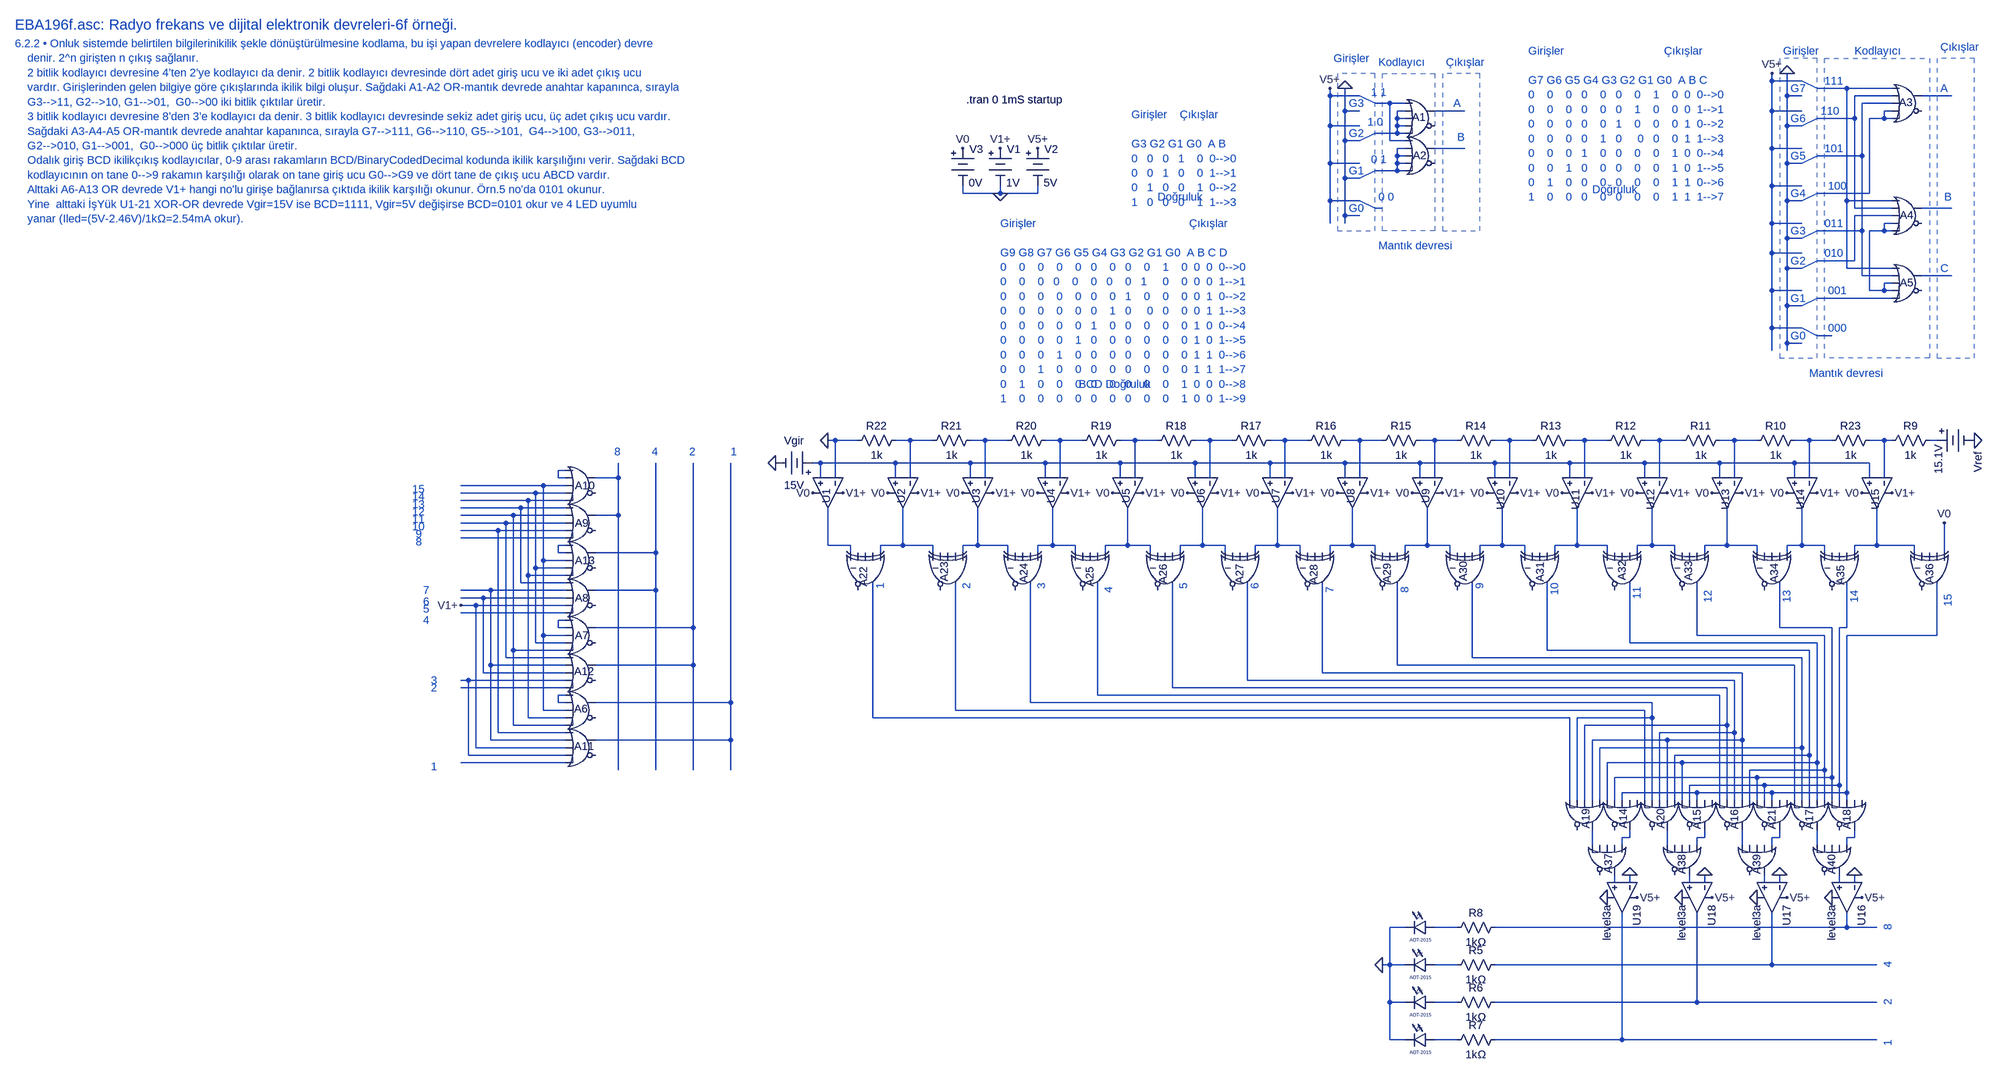
[diagram p0: schematic EBA196f.asc]
EBA196f.asc, the LTspice schematic file:
Version 4
SHEET 1 7064 4332
WIRE 3520 176 3520 160
WIRE 3584 176 3520 176
WIRE 3616 192 3584 176
WIRE 3680 192 3616 192
WIRE 3776 192 3680 192
WIRE 2576 208 2576 192
WIRE 2640 208 2576 208
WIRE 3552 208 3552 160
WIRE 3584 208 3552 208
WIRE 3776 208 3696 208
WIRE 3904 208 3840 208
WIRE 2672 224 2640 208
WIRE 2704 224 2672 224
WIRE 2736 224 2704 224
WIRE 3776 224 3712 224
WIRE 2608 240 2608 192
WIRE 2640 240 2608 240
WIRE 2736 240 2720 240
WIRE 2864 240 2800 240
WIRE 3520 240 3520 176
WIRE 3584 240 3520 240
WIRE 3776 240 3760 240
WIRE 2720 256 2720 240
WIRE 2736 256 2720 256
WIRE 3696 256 3696 208
WIRE 3696 256 3616 256
WIRE 3760 256 3760 240
WIRE 3760 256 3728 256
WIRE 3776 256 3760 256
WIRE 2576 272 2576 208
WIRE 2640 272 2576 272
WIRE 2720 272 2720 256
WIRE 2736 272 2720 272
WIRE 3552 272 3552 208
WIRE 3584 272 3616 256
WIRE 3584 272 3552 272
WIRE 2720 288 2720 272
WIRE 2720 288 2672 288
WIRE 2736 288 2720 288
WIRE 2608 304 2608 240
WIRE 2640 304 2672 288
WIRE 2640 304 2608 304
WIRE 2704 304 2704 224
WIRE 2736 304 2704 304
WIRE 2736 320 2720 320
WIRE 2864 320 2800 320
WIRE 3520 320 3520 240
WIRE 3584 320 3520 320
WIRE 2720 336 2720 320
WIRE 2736 336 2720 336
WIRE 3712 336 3712 224
WIRE 3712 336 3616 336
WIRE 2576 352 2576 272
WIRE 2640 352 2576 352
WIRE 2720 352 2720 336
WIRE 2736 352 2720 352
WIRE 3552 352 3552 272
WIRE 3584 352 3616 336
WIRE 3584 352 3552 352
WIRE 2720 368 2720 352
WIRE 2720 368 2672 368
WIRE 2736 368 2720 368
WIRE 2608 384 2608 304
WIRE 2640 384 2672 368
WIRE 2640 384 2608 384
WIRE 3520 400 3520 320
WIRE 3584 400 3520 400
WIRE 1792 416 1792 400
WIRE 1872 416 1872 400
WIRE 1872 416 1792 416
WIRE 1952 416 1952 400
WIRE 1952 416 1872 416
WIRE 3728 416 3728 256
WIRE 3728 416 3616 416
WIRE 2576 432 2576 352
WIRE 2640 432 2576 432
WIRE 3552 432 3552 352
WIRE 3584 432 3616 416
WIRE 3584 432 3552 432
WIRE 3680 432 3680 192
WIRE 3776 432 3680 432
WIRE 2672 448 2640 432
WIRE 2688 448 2672 448
WIRE 3696 448 3696 256
WIRE 3776 448 3696 448
WIRE 3904 448 3840 448
WIRE 2608 464 2608 384
WIRE 2640 464 2608 464
WIRE 3776 464 3696 464
WIRE 2576 480 2576 432
WIRE 2608 480 2608 464
WIRE 3520 480 3520 400
WIRE 3584 480 3520 480
WIRE 3776 480 3760 480
WIRE 3712 496 3712 336
WIRE 3712 496 3616 496
WIRE 3760 496 3760 480
WIRE 3760 496 3728 496
WIRE 3776 496 3760 496
WIRE 3552 512 3552 432
WIRE 3584 512 3616 496
WIRE 3584 512 3552 512
WIRE 3520 544 3520 480
WIRE 3584 544 3520 544
WIRE 3696 560 3696 464
WIRE 3696 560 3616 560
WIRE 3552 576 3552 512
WIRE 3584 576 3616 560
WIRE 3584 576 3552 576
WIRE 3680 576 3680 432
WIRE 3776 576 3680 576
WIRE 3712 592 3712 496
WIRE 3776 592 3712 592
WIRE 3904 592 3840 592
WIRE 3776 608 3760 608
WIRE 3520 624 3520 544
WIRE 3584 624 3520 624
WIRE 3728 624 3728 496
WIRE 3760 624 3760 608
WIRE 3760 624 3728 624
WIRE 3776 624 3760 624
WIRE 3776 640 3616 640
WIRE 3552 656 3552 576
WIRE 3584 656 3616 640
WIRE 3584 656 3552 656
WIRE 3520 704 3520 624
WIRE 3584 704 3520 704
WIRE 3616 720 3584 704
WIRE 3648 720 3616 720
WIRE 3552 736 3552 656
WIRE 3584 736 3552 736
WIRE 3520 752 3520 704
WIRE 3552 752 3552 736
WIRE 1520 944 1504 944
WIRE 1568 944 1520 944
WIRE 1680 944 1648 944
WIRE 1728 944 1680 944
WIRE 1840 944 1808 944
WIRE 1888 944 1840 944
WIRE 2000 944 1968 944
WIRE 2048 944 2000 944
WIRE 2160 944 2128 944
WIRE 2208 944 2160 944
WIRE 2320 944 2288 944
WIRE 2368 944 2320 944
WIRE 2480 944 2448 944
WIRE 2528 944 2480 944
WIRE 2640 944 2608 944
WIRE 2688 944 2640 944
WIRE 2800 944 2768 944
WIRE 2848 944 2800 944
WIRE 2960 944 2928 944
WIRE 3008 944 2960 944
WIRE 3120 944 3088 944
WIRE 3168 944 3120 944
WIRE 3280 944 3248 944
WIRE 3328 944 3280 944
WIRE 3440 944 3408 944
WIRE 3488 944 3440 944
WIRE 3600 944 3568 944
WIRE 3648 944 3600 944
WIRE 3760 944 3728 944
WIRE 3776 944 3760 944
WIRE 3872 944 3856 944
WIRE 1488 992 1472 992
WIRE 1648 992 1488 992
WIRE 1808 992 1648 992
WIRE 1968 992 1808 992
WIRE 2128 992 1968 992
WIRE 2288 992 2128 992
WIRE 2448 992 2288 992
WIRE 2608 992 2448 992
WIRE 2768 992 2608 992
WIRE 2928 992 2768 992
WIRE 3088 992 2928 992
WIRE 3248 992 3088 992
WIRE 3408 992 3248 992
WIRE 3568 992 3408 992
WIRE 3728 992 3568 992
WIRE 944 1008 928 1008
WIRE 928 1024 928 1008
WIRE 944 1024 928 1024
WIRE 1056 1024 1056 992
WIRE 1056 1024 1008 1024
WIRE 1488 1024 1488 992
WIRE 1520 1024 1520 944
WIRE 1648 1024 1648 992
WIRE 1680 1024 1680 944
WIRE 1808 1024 1808 992
WIRE 1840 1024 1840 944
WIRE 1968 1024 1968 992
WIRE 2000 1024 2000 944
WIRE 2128 1024 2128 992
WIRE 2160 1024 2160 944
WIRE 2288 1024 2288 992
WIRE 2320 1024 2320 944
WIRE 2448 1024 2448 992
WIRE 2480 1024 2480 944
WIRE 2608 1024 2608 992
WIRE 2640 1024 2640 944
WIRE 2768 1024 2768 992
WIRE 2800 1024 2800 944
WIRE 2928 1024 2928 992
WIRE 2960 1024 2960 944
WIRE 3088 1024 3088 992
WIRE 3120 1024 3120 944
WIRE 3248 1024 3248 992
WIRE 3280 1024 3280 944
WIRE 3408 1024 3408 992
WIRE 3440 1024 3440 944
WIRE 3568 1024 3568 992
WIRE 3600 1024 3600 944
WIRE 3728 1024 3728 992
WIRE 3760 1024 3760 944
WIRE 896 1040 720 1040
WIRE 944 1040 896 1040
WIRE 880 1056 720 1056
WIRE 944 1056 880 1056
WIRE 864 1072 720 1072
WIRE 944 1072 864 1072
WIRE 848 1088 720 1088
WIRE 944 1088 848 1088
WIRE 832 1104 720 1104
WIRE 944 1104 832 1104
WIRE 1056 1104 1056 1024
WIRE 1056 1104 1008 1104
WIRE 816 1120 720 1120
WIRE 944 1120 816 1120
WIRE 800 1136 720 1136
WIRE 944 1136 800 1136
WIRE 944 1152 720 1152
WIRE 944 1168 928 1168
WIRE 1504 1168 1504 1088
WIRE 1552 1168 1504 1168
WIRE 1664 1168 1664 1088
WIRE 1664 1168 1616 1168
WIRE 1728 1168 1664 1168
WIRE 1824 1168 1824 1088
WIRE 1824 1168 1792 1168
WIRE 1888 1168 1824 1168
WIRE 1984 1168 1984 1088
WIRE 1984 1168 1952 1168
WIRE 2032 1168 1984 1168
WIRE 2144 1168 2144 1088
WIRE 2144 1168 2096 1168
WIRE 2192 1168 2144 1168
WIRE 2304 1168 2304 1088
WIRE 2304 1168 2256 1168
WIRE 2352 1168 2304 1168
WIRE 2464 1168 2464 1088
WIRE 2464 1168 2416 1168
WIRE 2512 1168 2464 1168
WIRE 2624 1168 2624 1088
WIRE 2624 1168 2576 1168
WIRE 2672 1168 2624 1168
WIRE 2784 1168 2784 1088
WIRE 2784 1168 2736 1168
WIRE 2832 1168 2784 1168
WIRE 2944 1168 2944 1088
WIRE 2944 1168 2896 1168
WIRE 2992 1168 2944 1168
WIRE 3104 1168 3104 1088
WIRE 3104 1168 3056 1168
WIRE 3168 1168 3104 1168
WIRE 3264 1168 3264 1088
WIRE 3264 1168 3232 1168
WIRE 3312 1168 3264 1168
WIRE 3424 1168 3424 1088
WIRE 3424 1168 3376 1168
WIRE 3488 1168 3424 1168
WIRE 3584 1168 3584 1088
WIRE 3584 1168 3552 1168
WIRE 3632 1168 3584 1168
WIRE 3744 1168 3744 1088
WIRE 3744 1168 3696 1168
WIRE 3824 1168 3744 1168
WIRE 928 1184 928 1168
WIRE 944 1184 928 1184
WIRE 1136 1184 1136 992
WIRE 1136 1184 1008 1184
WIRE 1552 1184 1552 1168
WIRE 1616 1184 1616 1168
WIRE 1728 1184 1728 1168
WIRE 1792 1184 1792 1168
WIRE 1888 1184 1888 1168
WIRE 1952 1184 1952 1168
WIRE 2032 1184 2032 1168
WIRE 2096 1184 2096 1168
WIRE 2192 1184 2192 1168
WIRE 2256 1184 2256 1168
WIRE 2352 1184 2352 1168
WIRE 2416 1184 2416 1168
WIRE 2512 1184 2512 1168
WIRE 2576 1184 2576 1168
WIRE 2672 1184 2672 1168
WIRE 2736 1184 2736 1168
WIRE 2832 1184 2832 1168
WIRE 2896 1184 2896 1168
WIRE 2992 1184 2992 1168
WIRE 3056 1184 3056 1168
WIRE 3168 1184 3168 1168
WIRE 3232 1184 3232 1168
WIRE 3312 1184 3312 1168
WIRE 3376 1184 3376 1168
WIRE 3488 1184 3488 1168
WIRE 3552 1184 3552 1168
WIRE 3632 1184 3632 1168
WIRE 3696 1184 3696 1168
WIRE 3824 1184 3824 1168
WIRE 3888 1184 3888 1120
WIRE 896 1200 896 1040
WIRE 944 1200 896 1200
WIRE 880 1216 880 1056
WIRE 944 1216 880 1216
WIRE 864 1232 864 1072
WIRE 944 1232 864 1232
WIRE 848 1248 848 1088
WIRE 944 1248 848 1248
WIRE 784 1264 720 1264
WIRE 944 1264 784 1264
WIRE 1136 1264 1136 1184
WIRE 1136 1264 1008 1264
WIRE 768 1280 720 1280
WIRE 944 1280 768 1280
WIRE 752 1296 720 1296
WIRE 944 1296 752 1296
WIRE 944 1312 720 1312
WIRE 944 1328 928 1328
WIRE 928 1344 928 1328
WIRE 944 1344 928 1344
WIRE 1216 1344 1216 992
WIRE 1216 1344 1008 1344
WIRE 3536 1344 3536 1248
WIRE 3648 1344 3536 1344
WIRE 3680 1344 3680 1248
WIRE 3680 1344 3664 1344
WIRE 896 1360 896 1200
WIRE 944 1360 896 1360
WIRE 3360 1360 3360 1248
WIRE 3632 1360 3360 1360
WIRE 3872 1360 3872 1248
WIRE 3872 1360 3680 1360
WIRE 880 1376 880 1216
WIRE 944 1376 880 1376
WIRE 3216 1376 3216 1248
WIRE 3616 1376 3216 1376
WIRE 832 1392 832 1104
WIRE 944 1392 832 1392
WIRE 3040 1392 3040 1248
WIRE 3600 1392 3040 1392
WIRE 816 1408 816 1120
WIRE 944 1408 816 1408
WIRE 2880 1408 2880 1248
WIRE 3584 1408 2880 1408
WIRE 784 1424 784 1264
WIRE 944 1424 784 1424
WIRE 1216 1424 1216 1344
WIRE 1216 1424 1008 1424
WIRE 2720 1424 2720 1248
WIRE 3568 1424 2720 1424
WIRE 768 1440 768 1280
WIRE 944 1440 768 1440
WIRE 2560 1440 2560 1248
WIRE 3456 1440 2560 1440
WIRE 736 1456 720 1456
WIRE 944 1456 736 1456
WIRE 2400 1456 2400 1248
WIRE 3440 1456 2400 1456
WIRE 944 1472 720 1472
WIRE 2240 1472 2240 1248
WIRE 3424 1472 2240 1472
WIRE 944 1488 928 1488
WIRE 2080 1488 2080 1248
WIRE 3408 1488 2080 1488
WIRE 928 1504 928 1488
WIRE 944 1504 928 1504
WIRE 1296 1504 1296 992
WIRE 1296 1504 1008 1504
WIRE 1936 1504 1936 1248
WIRE 3264 1504 1936 1504
WIRE 896 1520 896 1360
WIRE 944 1520 896 1520
WIRE 1776 1520 1776 1248
WIRE 3248 1520 1776 1520
WIRE 864 1536 864 1232
WIRE 944 1536 864 1536
WIRE 1600 1536 1600 1248
WIRE 3088 1536 1600 1536
WIRE 3264 1536 3264 1504
WIRE 3264 1536 3104 1536
WIRE 832 1552 832 1392
WIRE 944 1552 832 1552
WIRE 3424 1552 3424 1472
WIRE 3424 1552 3120 1552
WIRE 800 1568 800 1136
WIRE 944 1568 800 1568
WIRE 3440 1568 3440 1456
WIRE 3440 1568 3280 1568
WIRE 784 1584 784 1424
WIRE 944 1584 784 1584
WIRE 1296 1584 1296 1504
WIRE 1296 1584 1008 1584
WIRE 3296 1584 3136 1584
WIRE 3456 1584 3456 1440
WIRE 3456 1584 3296 1584
WIRE 752 1600 752 1296
WIRE 944 1600 752 1600
WIRE 3584 1600 3584 1408
WIRE 3584 1600 3152 1600
WIRE 736 1616 736 1456
WIRE 944 1616 736 1616
WIRE 3600 1616 3600 1392
WIRE 3600 1616 3312 1616
WIRE 944 1632 720 1632
WIRE 3328 1632 3168 1632
WIRE 3616 1632 3616 1376
WIRE 3616 1632 3328 1632
WIRE 1056 1648 1056 1104
WIRE 1136 1648 1136 1264
WIRE 1216 1648 1216 1424
WIRE 1296 1648 1296 1584
WIRE 3632 1648 3632 1360
WIRE 3632 1648 3472 1648
WIRE 3488 1664 3184 1664
WIRE 3648 1664 3648 1344
WIRE 3648 1664 3488 1664
WIRE 3504 1680 3344 1680
WIRE 3664 1680 3664 1344
WIRE 3664 1680 3504 1680
WIRE 3360 1696 3200 1696
WIRE 3520 1696 3360 1696
WIRE 3680 1696 3680 1360
WIRE 3680 1696 3520 1696
WIRE 3088 1712 3088 1536
WIRE 3104 1712 3104 1536
WIRE 3120 1712 3120 1552
WIRE 3136 1712 3136 1584
WIRE 3152 1712 3152 1600
WIRE 3168 1712 3168 1632
WIRE 3184 1712 3184 1664
WIRE 3200 1712 3200 1696
WIRE 3248 1712 3248 1520
WIRE 3264 1712 3264 1536
WIRE 3280 1712 3280 1568
WIRE 3296 1712 3296 1584
WIRE 3312 1712 3312 1616
WIRE 3328 1712 3328 1632
WIRE 3344 1712 3344 1680
WIRE 3360 1712 3360 1696
WIRE 3408 1712 3408 1488
WIRE 3424 1712 3424 1552
WIRE 3440 1712 3440 1568
WIRE 3456 1712 3456 1584
WIRE 3472 1712 3472 1648
WIRE 3488 1712 3488 1664
WIRE 3504 1712 3504 1680
WIRE 3520 1712 3520 1696
WIRE 3568 1712 3568 1424
WIRE 3584 1712 3584 1600
WIRE 3600 1712 3600 1616
WIRE 3616 1712 3616 1632
WIRE 3632 1712 3632 1648
WIRE 3648 1712 3648 1664
WIRE 3664 1712 3664 1680
WIRE 3680 1712 3680 1696
WIRE 3216 1792 3216 1776
WIRE 3216 1792 3200 1792
WIRE 3376 1792 3376 1776
WIRE 3376 1792 3360 1792
WIRE 3536 1792 3536 1776
WIRE 3536 1792 3520 1792
WIRE 3696 1792 3696 1776
WIRE 3696 1792 3680 1792
WIRE 3136 1808 3136 1776
WIRE 3200 1808 3200 1792
WIRE 3296 1808 3296 1776
WIRE 3360 1808 3360 1792
WIRE 3456 1808 3456 1776
WIRE 3520 1808 3520 1792
WIRE 3616 1808 3616 1776
WIRE 3680 1808 3680 1792
WIRE 3184 1888 3184 1872
WIRE 3216 1888 3216 1872
WIRE 3344 1888 3344 1872
WIRE 3376 1888 3376 1872
WIRE 3504 1888 3504 1872
WIRE 3536 1888 3536 1872
WIRE 3664 1888 3664 1872
WIRE 3696 1888 3696 1872
WIRE 2736 1984 2704 1984
WIRE 2848 1984 2800 1984
WIRE 3680 1984 3680 1952
WIRE 3680 1984 2928 1984
WIRE 3744 1984 3680 1984
WIRE 2704 2064 2704 1984
WIRE 2704 2064 2688 2064
WIRE 2736 2064 2704 2064
WIRE 2848 2064 2800 2064
WIRE 3520 2064 3520 1952
WIRE 3520 2064 2928 2064
WIRE 3744 2064 3520 2064
WIRE 2704 2144 2704 2064
WIRE 2736 2144 2704 2144
WIRE 2848 2144 2800 2144
WIRE 3360 2144 3360 1952
WIRE 3360 2144 2928 2144
WIRE 3744 2144 3360 2144
WIRE 2704 2224 2704 2144
WIRE 2736 2224 2704 2224
WIRE 2848 2224 2800 2224
WIRE 3200 2224 3200 1952
WIRE 3200 2224 2928 2224
WIRE 3744 2224 3200 2224
FLAG 1872 320 V1+
FLAG 1952 320 V5+
FLAG 1872 416 0
FLAG 2576 192 V5+
FLAG 2608 192 0
FLAG 3520 160 V5+
FLAG 3552 160 0
FLAG 720 1296 V1+
FLAG 2688 2064 0
FLAG 1504 944 0
FLAG 3952 944 0
FLAG 1392 992 0
FLAG 1472 1056 V0
FLAG 1632 1056 V0
FLAG 1792 1056 V0
FLAG 1952 1056 V0
FLAG 2112 1056 V0
FLAG 2272 1056 V0
FLAG 2432 1056 V0
FLAG 2592 1056 V0
FLAG 2752 1056 V0
FLAG 2912 1056 V0
FLAG 3072 1056 V0
FLAG 3232 1056 V0
FLAG 3392 1056 V0
FLAG 3552 1056 V0
FLAG 3712 1056 V0
FLAG 3776 1056 V1+
FLAG 3616 1056 V1+
FLAG 3456 1056 V1+
FLAG 3296 1056 V1+
FLAG 3136 1056 V1+
FLAG 2976 1056 V1+
FLAG 2816 1056 V1+
FLAG 2656 1056 V1+
FLAG 2496 1056 V1+
FLAG 2336 1056 V1+
FLAG 2176 1056 V1+
FLAG 2016 1056 V1+
FLAG 1856 1056 V1+
FLAG 1696 1056 V1+
FLAG 1536 1056 V1+
FLAG 3888 1120 V0
FLAG 1792 320 V0
FLAG 3648 1920 0
FLAG 3488 1920 0
FLAG 3328 1920 0
FLAG 3168 1920 0
FLAG 3712 1920 V5+
FLAG 3552 1920 V5+
FLAG 3392 1920 V5+
FLAG 3232 1920 V5+
FLAG 3696 1872 0
FLAG 3536 1872 0
FLAG 3376 1872 0
FLAG 3216 1872 0
SYMBOL Misc\\battery 1872 304 R0
WINDOW 0 14 18 Left 2
WINDOW 3 13 90 Left 2
SYMATTR InstName V1
SYMATTR Value 1V
SYMBOL Misc\\battery 1952 304 R0
WINDOW 0 14 18 Left 2
WINDOW 3 13 90 Left 2
SYMATTR InstName V2
SYMATTR Value 5V
SYMBOL Digital\\or 2768 192 R0
WINDOW 0 -17 62 Left 2
SYMATTR InstName A1
SYMBOL Digital\\or 2768 272 R0
WINDOW 0 -15 63 Left 2
SYMATTR InstName A2
SYMBOL Digital\\or 3808 160 R0
WINDOW 0 -17 62 Left 2
SYMATTR InstName A3
SYMBOL Digital\\or 3808 400 R0
WINDOW 0 -15 63 Left 2
SYMATTR InstName A4
SYMBOL Digital\\or 3808 544 R0
WINDOW 0 -15 63 Left 2
SYMATTR InstName A5
SYMBOL Digital\\or 976 1456 R0
WINDOW 0 -14 61 Left 2
SYMATTR InstName A6
SYMBOL Digital\\or 976 1296 R0
WINDOW 0 -12 64 Left 2
SYMATTR InstName A7
SYMBOL Digital\\or 976 1216 R0
WINDOW 0 -12 64 Left 2
SYMATTR InstName A8
SYMBOL Digital\\or 976 1056 R0
WINDOW 0 -12 64 Left 2
SYMATTR InstName A9
SYMBOL Digital\\or 976 976 R0
WINDOW 0 -12 64 Left 2
SYMATTR InstName A10
SYMBOL Digital\\or 976 1536 R0
WINDOW 0 -14 61 Left 2
SYMATTR InstName A11
SYMBOL Digital\\or 976 1376 R0
WINDOW 0 -14 61 Left 2
SYMATTR InstName A12
SYMBOL Digital\\or 976 1136 R0
WINDOW 0 -12 64 Left 2
SYMATTR InstName A13
SYMBOL res 2944 2048 R90
WINDOW 0 0 56 VBottom 2
WINDOW 3 32 56 VTop 2
SYMATTR InstName R5
SYMATTR Value 1kΩ
SYMBOL res 2944 2128 R90
WINDOW 0 0 56 VBottom 2
WINDOW 3 32 56 VTop 2
SYMATTR InstName R6
SYMATTR Value 1kΩ
SYMBOL res 2944 2208 R90
WINDOW 0 0 56 VBottom 2
WINDOW 3 32 56 VTop 2
SYMATTR InstName R7
SYMATTR Value 1kΩ
SYMBOL res 2944 1968 R90
WINDOW 0 0 56 VBottom 2
WINDOW 3 32 56 VTop 2
SYMATTR InstName R8
SYMATTR Value 1kΩ
SYMBOL Digital\\or 3264 1744 R90
WINDOW 0 -14 61 Left 2
SYMATTR InstName A14
SYMBOL Digital\\or 3424 1744 R90
WINDOW 0 -12 64 Left 2
SYMATTR InstName A15
SYMBOL Digital\\or 3504 1744 R90
WINDOW 0 -12 64 Left 2
SYMATTR InstName A16
SYMBOL Digital\\or 3664 1744 R90
WINDOW 0 -12 64 Left 2
SYMATTR InstName A17
SYMBOL Digital\\or 3744 1744 R90
WINDOW 0 -12 64 Left 2
SYMATTR InstName A18
SYMBOL Digital\\or 3184 1744 R90
WINDOW 0 -14 61 Left 2
SYMATTR InstName A19
SYMBOL Digital\\or 3344 1744 R90
WINDOW 0 -14 61 Left 2
SYMATTR InstName A20
SYMBOL Digital\\or 3584 1744 R90
WINDOW 0 -12 64 Left 2
SYMATTR InstName A21
SYMBOL res 3872 928 R90
WINDOW 0 0 56 VBottom 2
WINDOW 3 32 56 VTop 2
SYMATTR InstName R9
SYMATTR Value 1k
SYMBOL res 3584 928 R90
WINDOW 0 0 56 VBottom 2
WINDOW 3 32 56 VTop 2
SYMATTR InstName R10
SYMATTR Value 1k
SYMBOL res 3424 928 R90
WINDOW 0 0 56 VBottom 2
WINDOW 3 32 56 VTop 2
SYMATTR InstName R11
SYMATTR Value 1k
SYMBOL res 3264 928 R90
WINDOW 0 0 56 VBottom 2
WINDOW 3 32 56 VTop 2
SYMATTR InstName R12
SYMATTR Value 1k
SYMBOL res 3104 928 R90
WINDOW 0 0 56 VBottom 2
WINDOW 3 32 56 VTop 2
SYMATTR InstName R13
SYMATTR Value 1k
SYMBOL res 2944 928 R90
WINDOW 0 0 56 VBottom 2
WINDOW 3 32 56 VTop 2
SYMATTR InstName R14
SYMATTR Value 1k
SYMBOL res 2784 928 R90
WINDOW 0 0 56 VBottom 2
WINDOW 3 32 56 VTop 2
SYMATTR InstName R15
SYMATTR Value 1k
SYMBOL res 2624 928 R90
WINDOW 0 0 56 VBottom 2
WINDOW 3 32 56 VTop 2
SYMATTR InstName R16
SYMATTR Value 1k
SYMBOL res 2464 928 R90
WINDOW 0 0 56 VBottom 2
WINDOW 3 32 56 VTop 2
SYMATTR InstName R17
SYMATTR Value 1k
SYMBOL res 2304 928 R90
WINDOW 0 0 56 VBottom 2
WINDOW 3 32 56 VTop 2
SYMATTR InstName R18
SYMATTR Value 1k
SYMBOL res 2144 928 R90
WINDOW 0 0 56 VBottom 2
WINDOW 3 32 56 VTop 2
SYMATTR InstName R19
SYMATTR Value 1k
SYMBOL res 1984 928 R90
WINDOW 0 0 56 VBottom 2
WINDOW 3 32 56 VTop 2
SYMATTR InstName R20
SYMATTR Value 1k
SYMBOL res 1824 928 R90
WINDOW 0 0 56 VBottom 2
WINDOW 3 32 56 VTop 2
SYMATTR InstName R21
SYMATTR Value 1k
SYMBOL res 1664 928 R90
WINDOW 0 0 56 VBottom 2
WINDOW 3 32 56 VTop 2
SYMATTR InstName R22
SYMATTR Value 1k
SYMBOL Misc\\battery 3856 944 M90
WINDOW 0 24 104 Left 2
WINDOW 3 9 20 Left 2
WINDOW 123 0 0 Left 0
WINDOW 39 0 0 Left 0
SYMATTR InstName Vref
SYMATTR Value 15.1V
SYMBOL res 3744 928 R90
WINDOW 0 0 56 VBottom 2
WINDOW 3 32 56 VTop 2
SYMATTR InstName R23
SYMATTR Value 1k
SYMBOL Misc\\battery 1488 992 M270
WINDOW 0 32 56 VTop 2
WINDOW 3 -32 56 VBottom 2
WINDOW 123 0 0 Left 0
WINDOW 39 0 0 Left 0
SYMATTR InstName Vgir
SYMATTR Value 15V
SYMBOL OpAmps\\UniversalOpAmp 1504 1056 R90
WINDOW 0 -8 3 Left 2
SYMATTR InstName U1
SYMBOL OpAmps\\UniversalOpAmp 1664 1056 R90
WINDOW 0 -8 3 Left 2
SYMATTR InstName U2
SYMBOL OpAmps\\UniversalOpAmp 1824 1056 R90
WINDOW 0 -8 3 Left 2
SYMATTR InstName U3
SYMBOL OpAmps\\UniversalOpAmp 1984 1056 R90
WINDOW 0 -8 3 Left 2
SYMATTR InstName U4
SYMBOL OpAmps\\UniversalOpAmp 2144 1056 R90
WINDOW 0 -8 3 Left 2
SYMATTR InstName U5
SYMBOL OpAmps\\UniversalOpAmp 2304 1056 R90
WINDOW 0 -8 3 Left 2
SYMATTR InstName U6
SYMBOL OpAmps\\UniversalOpAmp 2464 1056 R90
WINDOW 0 -8 3 Left 2
SYMATTR InstName U7
SYMBOL OpAmps\\UniversalOpAmp 2624 1056 R90
WINDOW 0 -8 3 Left 2
SYMATTR InstName U8
SYMBOL OpAmps\\UniversalOpAmp 2784 1056 R90
WINDOW 0 -8 3 Left 2
SYMATTR InstName U9
SYMBOL OpAmps\\UniversalOpAmp 2944 1056 R90
WINDOW 0 -8 3 Left 2
SYMATTR InstName U10
SYMBOL OpAmps\\UniversalOpAmp 3104 1056 R90
WINDOW 0 -8 3 Left 2
SYMATTR InstName U11
SYMBOL OpAmps\\UniversalOpAmp 3264 1056 R90
WINDOW 0 -8 3 Left 2
SYMATTR InstName U12
SYMBOL OpAmps\\UniversalOpAmp 3424 1056 R90
WINDOW 0 -8 3 Left 2
SYMATTR InstName U13
SYMBOL OpAmps\\UniversalOpAmp 3584 1056 R90
WINDOW 0 -8 3 Left 2
SYMATTR InstName U14
SYMBOL OpAmps\\UniversalOpAmp 3744 1056 R90
WINDOW 0 -8 3 Left 2
SYMATTR InstName U15
SYMBOL Digital\\xor 1648 1232 R90
WINDOW 0 -18 68 Left 2
SYMATTR InstName A22
SYMBOL Digital\\xor 1824 1232 R90
WINDOW 0 -29 71 Left 2
SYMATTR InstName A23
SYMBOL Digital\\xor 1984 1232 R90
WINDOW 0 -26 61 Left 2
SYMATTR InstName A24
SYMBOL Digital\\xor 2128 1232 R90
WINDOW 0 -18 64 Left 2
SYMATTR InstName A25
SYMBOL Digital\\xor 2288 1232 R90
WINDOW 0 -24 68 Left 2
SYMATTR InstName A26
SYMBOL Digital\\xor 2448 1232 R90
WINDOW 0 -24 64 Left 2
SYMATTR InstName A27
SYMBOL Digital\\xor 2608 1232 R90
WINDOW 0 -23 66 Left 2
SYMATTR InstName A28
SYMBOL Digital\\xor 2768 1232 R90
WINDOW 0 -26 69 Left 2
SYMATTR InstName A29
SYMBOL Digital\\xor 2928 1232 R90
WINDOW 0 -30 67 Left 2
SYMATTR InstName A30
SYMBOL Digital\\xor 3088 1232 R90
WINDOW 0 -28 63 Left 2
SYMATTR InstName A31
SYMBOL Digital\\xor 3264 1232 R90
WINDOW 0 -32 64 Left 2
SYMATTR InstName A32
SYMBOL Digital\\xor 3408 1232 R90
WINDOW 0 -31 66 Left 2
SYMATTR InstName A33
SYMBOL Digital\\xor 3584 1232 R90
WINDOW 0 -26 59 Left 2
SYMATTR InstName A34
SYMBOL Digital\\xor 3728 1232 R90
WINDOW 0 -22 61 Left 2
SYMATTR InstName A35
SYMBOL Digital\\xor 3920 1232 R90
WINDOW 0 -25 63 Left 2
SYMATTR InstName A36
SYMBOL Digital\\or 3232 1840 R90
WINDOW 0 -14 61 Left 2
SYMATTR InstName A37
SYMBOL Digital\\or 3392 1840 R90
WINDOW 0 -12 64 Left 2
SYMATTR InstName A38
SYMBOL Digital\\or 3552 1840 R90
WINDOW 0 -12 64 Left 2
SYMATTR InstName A39
SYMBOL Digital\\or 3712 1840 R90
WINDOW 0 -12 64 Left 2
SYMATTR InstName A40
SYMBOL Misc\\battery 1792 304 R0
WINDOW 0 14 18 Left 2
WINDOW 3 13 90 Left 2
SYMATTR InstName V3
SYMATTR Value 0V
SYMBOL LED 2800 1968 R90
WINDOW 0 0 32 VBottom 0
WINDOW 3 37 30 VTop 0
SYMATTR InstName D1
SYMATTR Value AOT-2015
SYMATTR Description Diode
SYMATTR Type diode
SYMBOL LED 2800 2048 R90
WINDOW 0 0 32 VBottom 0
WINDOW 3 37 30 VTop 0
SYMATTR InstName D2
SYMATTR Value AOT-2015
SYMATTR Description Diode
SYMATTR Type diode
SYMBOL LED 2800 2128 R90
WINDOW 0 0 32 VBottom 0
WINDOW 3 37 30 VTop 0
SYMATTR InstName D3
SYMATTR Value AOT-2015
SYMATTR Description Diode
SYMATTR Type diode
SYMBOL LED 2800 2208 R90
WINDOW 0 0 32 VBottom 0
WINDOW 3 37 30 VTop 0
SYMATTR InstName D4
SYMATTR Value AOT-2015
SYMATTR Description Diode
SYMATTR Type diode
SYMBOL OpAmps\\UniversalOpAmp3 3680 1920 R90
SYMATTR InstName U16
SYMBOL OpAmps\\UniversalOpAmp3 3520 1920 R90
SYMATTR InstName U17
SYMBOL OpAmps\\UniversalOpAmp3 3360 1920 R90
SYMATTR InstName U18
SYMBOL OpAmps\\UniversalOpAmp3 3200 1920 R90
SYMATTR InstName U19
TEXT -232 56 Left 3 ;EBA196f.asc: Radyo frekans ve dijital elektronik devreleri-6f örneği.
TEXT -232 96 Left 2 ;6.2.2 • Onluk sistemde belirtilen bilgilerinikilik şekle dönüştürülmesine kodlama, bu işi yapan devrelere kodlayıcı (encoder) devre \n    denir. 2^n girişten n çıkış sağlanır.\n    2 bitlik kodlayıcı devresine 4’ten 2’ye kodlayıcı da denir. 2 bitlik kodlayıcı devresinde dört adet giriş ucu ve iki adet çıkış ucu\n    vardır. Girişlerinden gelen bilgiye göre çıkışlarında ikilik bilgi oluşur. Sağdaki A1-A2 OR-mantık devrede anahtar kapanınca, sırayla\n    G3-->11, G2-->10, G1-->01,  G0-->00 iki bitlik çıktılar üretir.\n    3 bitlik kodlayıcı devresine 8’den 3’e kodlayıcı da denir. 3 bitlik kodlayıcı devresinde sekiz adet giriş ucu, üç adet çıkış ucu vardır.\n    Sağdaki A3-A4-A5 OR-mantık devrede anahtar kapanınca, sırayla G7-->111, G6-->110, G5-->101,  G4-->100, G3-->011, \n    G2-->010, G1-->001,  G0-->000 üç bitlik çıktılar üretir.\n    Odalık giriş BCD ikilikçıkış kodlayıcılar, 0-9 arası rakamların BCD/BinaryCodedDecimal kodunda ikilik karşılığını verir. Sağdaki BCD \n    kodlayıcının on tane 0-->9 rakamın karşılığı olarak on tane giriş ucu G0-->G9 ve dört tane de çıkış ucu ABCD vardır.\n    Alttaki A6-A13 OR devrede V1+ hangi no'lu girişe bağlanırsa çıktıda ikilik karşılığı okunur. Örn.5 no'da 0101 okunur.\n    Yine  alttaki İşYük U1-21 XOR-OR devrede Vgir=15V ise BCD=1111, Vgir=5V değişirse BCD=0101 okur ve 4 LED uyumlu\n    yanar (Iled=(5V-2.46V)/1kΩ=2.54mA okur).
TEXT 1800 216 Left 2 !.tran 0 1mS startup
TEXT 2152 248 Left 2 ;Girişler    Çıkışlar\n\nG3 G2 G1 G0  A B\n0   0   0   1    0  0-->0\n0   0   1   0    0  1-->1\n0   1   0   0    1  0-->2\n1   0   0   0    1  1-->3
TEXT 2616 224 Left 2 ;G3
TEXT 2616 288 Left 2 ;G2
TEXT 2616 368 Left 2 ;G1
TEXT 2616 448 Left 2 ;G0
TEXT 2840 224 Left 2 ;A
TEXT 2848 296 Left 2 ;B
TEXT 2664 200 Left 2 ;1 1
TEXT 2656 264 Left 2 ;1 0
TEXT 2664 344 Left 2 ;0 1
TEXT 2680 424 Left 2 ;0 0
TEXT 2208 424 Left 2 ;Doğruluk
TEXT 2680 528 Left 2 ;Mantık devresi
TEXT 2584 128 Left 2 ;Girişler
TEXT 2680 136 Left 2 ;Kodlayıcı
TEXT 2824 136 Left 2 ;Çıkışlar
TEXT 3000 112 Left 2 ;Girişler                                Çıkışlar\n\nG7 G6 G5 G4 G3 G2 G1 G0  A B C\n0    0    0   0    0   0    0    1    0  0  0-->0\n0    0    0   0    0   0    1    0    0  0  1-->1\n0    0    0   0    0   1    0    0    0  1  0-->2\n0    0    0   0    1   0     0   0    0  1  1-->3\n0    0    0   1    0   0    0    0    1  0  0-->4\n0    0    1   0    0   0    0    0    1  0  1-->5\n0    1    0   0    0   0    0    0    1  1  0-->6\n1    0    0   0    0   0    0    0    1  1  1-->7
TEXT 3560 192 Left 2 ;G7
TEXT 3560 256 Left 2 ;G6
TEXT 3560 336 Left 2 ;G5
TEXT 3560 416 Left 2 ;G4
TEXT 3880 192 Left 2 ;A
TEXT 3888 424 Left 2 ;B
TEXT 3632 176 Left 2 ;111
TEXT 3624 240 Left 2 ;110
TEXT 3632 320 Left 2 ;101
TEXT 3640 400 Left 2 ;100
TEXT 3136 408 Left 2 ;Doğruluk
TEXT 3600 800 Left 2 ;Mantık devresi
TEXT 3544 112 Left 2 ;Girişler
TEXT 3696 112 Left 2 ;Kodlayıcı
TEXT 3880 104 Left 2 ;Çıkışlar
TEXT 3560 496 Left 2 ;G3
TEXT 3560 560 Left 2 ;G2
TEXT 3560 640 Left 2 ;G1
TEXT 3560 720 Left 2 ;G0
TEXT 3632 544 Left 2 ;010
TEXT 3640 624 Left 2 ;001
TEXT 3632 480 Left 2 ;011
TEXT 3640 704 Left 2 ;000
TEXT 3880 576 Left 2 ;C
TEXT 1872 480 Left 2 ;Girişler                                                 Çıkışlar\n\nG9 G8 G7 G6 G5 G4 G3 G2 G1 G0  A B C D\n0    0    0    0    0   0    0   0    0    1    0  0  0  0-->0\n0    0    0   0    0    0   0    0   1     0    0  0  0  1-->1\n0    0    0    0    0   0    0   1    0    0    0  0  1  0-->2\n0    0    0    0    0   0    1   0     0   0    0  0  1  1-->3\n0    0    0    0    0   1    0   0    0    0    0  1  0  0-->4\n0    0    0    0    1   0    0   0    0    0    0  1  0  1-->5\n0    0    0    1    0   0    0   0    0    0    0  1  1  0-->6\n0    0    1    0    0   0    0   0    0    0    0  1  1  1-->7\n0    1    0    0    0   0    0   0    0    0    1  0  0  0-->8\n1    0    0    0    0   0    0   0    0    0    1  0  0  1-->9
TEXT 2040 824 Left 2 ;BCD Doğruluk
TEXT 1296 968 Left 2 ;1
TEXT 1208 968 Left 2 ;2
TEXT 1128 968 Left 2 ;4
TEXT 1048 968 Left 2 ;8
TEXT 656 1640 Left 2 ;1
TEXT 656 1472 Left 2 ;2
TEXT 640 1328 Left 2 ;4
TEXT 624 1160 Left 2 ;8
TEXT 656 1456 Left 2 ;3
TEXT 640 1304 Left 2 ;5
TEXT 640 1288 Left 2 ;6
TEXT 640 1264 Left 2 ;7
TEXT 624 1144 Left 2 ;9
TEXT 616 1128 Left 2 ;10
TEXT 616 1112 Left 2 ;11
TEXT 616 1096 Left 2 ;12
TEXT 616 1080 Left 2 ;13
TEXT 616 1064 Left 2 ;14
TEXT 616 1048 Left 2 ;15
TEXT 3768 2224 VRight 2 ;1
TEXT 3768 2136 VRight 2 ;2
TEXT 3768 2056 VRight 2 ;4
TEXT 3768 1976 VRight 2 ;8
TEXT 1616 1248 VRight 2 ;1
TEXT 1800 1248 VRight 2 ;2
TEXT 2104 1256 VRight 2 ;4
TEXT 2736 1256 VRight 2 ;8
TEXT 1960 1248 VRight 2 ;3
TEXT 2264 1248 VRight 2 ;5
TEXT 2416 1248 VRight 2 ;6
TEXT 2576 1256 VRight 2 ;7
TEXT 2896 1248 VRight 2 ;9
TEXT 3056 1248 VRight 2 ;10
TEXT 3232 1256 VRight 2 ;11
TEXT 3384 1264 VRight 2 ;12
TEXT 3552 1264 VRight 2 ;13
TEXT 3696 1264 VRight 2 ;14
TEXT 3896 1272 VRight 2 ;15
RECTANGLE Normal 2592 496 2672 160 2
RECTANGLE Normal 2800 496 2688 160 2
RECTANGLE Normal 2816 496 2896 160 2
RECTANGLE Normal 3536 768 3616 128 2
RECTANGLE Normal 3856 768 3632 128 2
RECTANGLE Normal 3872 768 3952 128 2

The netlist it stands for:
* EBA196f.asc
V1 V1+ 0 1V
V2 V5+ 0 5V
A1 V5+ 0 0 0 0 0 N002 0 OR
A2 V5+ 0 0 0 0 0 N003 0 OR
A3 V5+ 0 0 0 0 0 N001 0 OR
A4 V5+ 0 0 N005 N005 0 N004 0 OR
A5 V5+ 0 N005 N005 0 0 N006 0 OR
A6 N068 N068 N025 N027 N029 0 N070 0 OR
A7 N053 N053 N025 N026 N029 0 N054 0 OR
A8 N028 N050 N051 V1+ N052 0 N049 0 OR
A9 N028 N029 N030 N031 N032 0 N024 0 OR
A10 N023 N023 N025 N026 N027 0 N024 0 OR
A11 N031 N050 V1+ N064 N074 0 N070 0 OR
A12 N030 N050 N051 N064 N066 0 N054 0 OR
A13 N033 N033 N025 N026 N027 0 N049 0 OR
R5 N090 N089 1kΩ
R6 N092 N091 1kΩ
R7 N094 N093 1kΩ
R8 N088 N087 1kΩ
A14 0 0 N058 N055 N059 0 N075 0 OR
A15 0 0 N058 N056 N059 0 N076 0 OR
A16 N057 N063 N065 N067 N069 0 N081 0 OR
A17 N057 N059 N060 N061 N062 0 N082 0 OR
A18 0 0 N058 N056 N055 0 N078 0 OR
A19 N061 N063 N067 N071 N073 0 N079 0 OR
A20 N060 N063 N065 N071 N072 0 N080 0 OR
A21 0 0 N058 N056 N055 0 N077 0 OR
R9 N021 N020 1k
R10 N019 N018 1k
R11 N018 N017 1k
R12 N017 N016 1k
R13 N016 N015 1k
R14 N015 N014 1k
R15 N014 N013 1k
R16 N013 N012 1k
R17 N012 N011 1k
R18 N011 N010 1k
R19 N010 N009 1k
R20 N009 N008 1k
R21 N008 N007 1k
R22 N007 0 1k
Vref N021 0 15.1V
R23 N020 N019 1k
Vgir N022 0 15V
XU1 N022 0 V1+ V0 N034 level1 Avol=1Meg GBW=10Meg Vos=0 En=0 Enk=0 In=0 Ink=0 Rin=500Meg  ; pins In+ In- V+ V- OUT
XU2 N022 N007 V1+ V0 N035 level1 Avol=1Meg GBW=10Meg Vos=0 En=0 Enk=0 In=0 Ink=0 Rin=500Meg  ; pins In+ In- V+ V- OUT
XU3 N022 N008 V1+ V0 N036 level1 Avol=1Meg GBW=10Meg Vos=0 En=0 Enk=0 In=0 Ink=0 Rin=500Meg  ; pins In+ In- V+ V- OUT
XU4 N022 N009 V1+ V0 N037 level1 Avol=1Meg GBW=10Meg Vos=0 En=0 Enk=0 In=0 Ink=0 Rin=500Meg  ; pins In+ In- V+ V- OUT
XU5 N022 N010 V1+ V0 N038 level1 Avol=1Meg GBW=10Meg Vos=0 En=0 Enk=0 In=0 Ink=0 Rin=500Meg  ; pins In+ In- V+ V- OUT
XU6 N022 N011 V1+ V0 N039 level1 Avol=1Meg GBW=10Meg Vos=0 En=0 Enk=0 In=0 Ink=0 Rin=500Meg  ; pins In+ In- V+ V- OUT
XU7 N022 N012 V1+ V0 N040 level1 Avol=1Meg GBW=10Meg Vos=0 En=0 Enk=0 In=0 Ink=0 Rin=500Meg  ; pins In+ In- V+ V- OUT
XU8 N022 N013 V1+ V0 N041 level1 Avol=1Meg GBW=10Meg Vos=0 En=0 Enk=0 In=0 Ink=0 Rin=500Meg  ; pins In+ In- V+ V- OUT
XU9 N022 N014 V1+ V0 N042 level1 Avol=1Meg GBW=10Meg Vos=0 En=0 Enk=0 In=0 Ink=0 Rin=500Meg  ; pins In+ In- V+ V- OUT
XU10 N022 N015 V1+ V0 N043 level1 Avol=1Meg GBW=10Meg Vos=0 En=0 Enk=0 In=0 Ink=0 Rin=500Meg  ; pins In+ In- V+ V- OUT
XU11 N022 N016 V1+ V0 N044 level1 Avol=1Meg GBW=10Meg Vos=0 En=0 Enk=0 In=0 Ink=0 Rin=500Meg  ; pins In+ In- V+ V- OUT
XU12 N022 N017 V1+ V0 N045 level1 Avol=1Meg GBW=10Meg Vos=0 En=0 Enk=0 In=0 Ink=0 Rin=500Meg  ; pins In+ In- V+ V- OUT
XU13 N022 N018 V1+ V0 N046 level1 Avol=1Meg GBW=10Meg Vos=0 En=0 Enk=0 In=0 Ink=0 Rin=500Meg  ; pins In+ In- V+ V- OUT
XU14 N022 N019 V1+ V0 N047 level1 Avol=1Meg GBW=10Meg Vos=0 En=0 Enk=0 In=0 Ink=0 Rin=500Meg  ; pins In+ In- V+ V- OUT
XU15 N022 N020 V1+ V0 N048 level1 Avol=1Meg GBW=10Meg Vos=0 En=0 Enk=0 In=0 Ink=0 Rin=500Meg  ; pins In+ In- V+ V- OUT
A22 N035 0 0 0 N034 0 N073 0 XOR
A23 N036 0 0 0 N035 0 N072 0 XOR
A24 N037 0 0 0 N036 0 N071 0 XOR
A25 N038 0 0 0 N037 0 N069 0 XOR
A26 N039 0 0 0 N038 0 N067 0 XOR
A27 N040 0 0 0 N039 0 N065 0 XOR
A28 N041 0 0 0 N040 0 N063 0 XOR
A29 N042 0 0 0 N041 0 N062 0 XOR
A30 N043 0 0 0 N042 0 N061 0 XOR
A31 N044 0 0 0 N043 0 N060 0 XOR
A32 N045 0 0 0 N044 0 N059 0 XOR
A33 N046 0 0 0 N045 0 N057 0 XOR
A34 N047 0 0 0 N046 0 N055 0 XOR
A35 N048 0 0 0 N047 0 N056 0 XOR
A36 V0 0 0 0 N048 0 N058 0 XOR
A37 N075 0 0 0 N079 0 N083 0 OR
A38 N076 0 0 0 N080 0 N084 0 OR
A39 N077 0 0 0 N081 0 N085 0 OR
A40 N078 0 0 0 N082 0 N086 0 OR
V3 V0 0 0V
D1 N087 0 AOT-2015
D2 N089 0 AOT-2015
D3 N091 0 AOT-2015
D4 N093 0 AOT-2015
XU16 N086 0 V5+ 0 N088 level3a  ; pins In+ In- V+ V- OUT
XU17 N085 0 V5+ 0 N090 level3a  ; pins In+ In- V+ V- OUT
XU18 N084 0 V5+ 0 N092 level3a  ; pins In+ In- V+ V- OUT
XU19 N083 0 V5+ 0 N094 level3a  ; pins In+ In- V+ V- OUT
.model D D
.lib standard.dio
* EBA196f.asc: Radyo frekans ve dijital elektronik devreleri-6f örneği.
* 6.2.2 • Onluk sistemde belirtilen bilgilerinikilik şekle dönüştürülmesine kodlama, bu işi yapan devrelere kodlayıcı (encoder) devre
*     denir. 2^n girişten n çıkış sağlanır.
*     2 bitlik kodlayıcı devresine 4’ten 2’ye kodlayıcı da denir. 2 bitlik kodlayıcı devresinde dört adet giriş ucu ve iki adet çıkış ucu
*     vardır. Girişlerinden gelen bilgiye göre çıkışlarında ikilik bilgi oluşur. Sağdaki A1-A2 OR-mantık devrede anahtar kapanınca, sırayla
*     G3-->11, G2-->10, G1-->01,  G0-->00 iki bitlik çıktılar üretir.
*     3 bitlik kodlayıcı devresine 8’den 3’e kodlayıcı da denir. 3 bitlik kodlayıcı devresinde sekiz adet giriş ucu, üç adet çıkış ucu vardır.
*     Sağdaki A3-A4-A5 OR-mantık devrede anahtar kapanınca, sırayla G7-->111, G6-->110, G5-->101,  G4-->100, G3-->011,
*     G2-->010, G1-->001,  G0-->000 üç bitlik çıktılar üretir.
*     Odalık giriş BCD ikilikçıkış kodlayıcılar, 0-9 arası rakamların BCD/BinaryCodedDecimal kodunda ikilik karşılığını verir. Sağdaki BCD
*     kodlayıcının on tane 0-->9 rakamın karşılığı olarak on tane giriş ucu G0-->G9 ve dört tane de çıkış ucu ABCD vardır.
*     Alttaki A6-A13 OR devrede V1+ hangi no'lu girişe bağlanırsa çıktıda ikilik karşılığı okunur. Örn.5 no'da 0101 okunur.
*     Yine  alttaki İşYük U1-21 XOR-OR devrede Vgir=15V ise BCD=1111, Vgir=5V değişirse BCD=0101 okur ve 4 LED uyumlu
*     yanar (Iled=(5V-2.46V)/1kΩ=2.54mA okur).
.tran 0 1mS startup
* Girişler    Çıkışlar
* G3 G2 G1 G0  A B
* 0   0   0   1    0  0-->0
* 0   0   1   0    0  1-->1
* 0   1   0   0    1  0-->2
* 1   0   0   0    1  1-->3
* G3
* G2
* G1
* G0
* A
* B
* 1 1
* 1 0
* 0 1
* 0 0
* Doğruluk
* Mantık devresi
* Girişler
* Kodlayıcı
* Çıkışlar
* Girişler                                Çıkışlar
* G7 G6 G5 G4 G3 G2 G1 G0  A B C
* 0    0    0   0    0   0    0    1    0  0  0-->0
* 0    0    0   0    0   0    1    0    0  0  1-->1
* 0    0    0   0    0   1    0    0    0  1  0-->2
* 0    0    0   0    1   0     0   0    0  1  1-->3
* 0    0    0   1    0   0    0    0    1  0  0-->4
* 0    0    1   0    0   0    0    0    1  0  1-->5
* 0    1    0   0    0   0    0    0    1  1  0-->6
* 1    0    0   0    0   0    0    0    1  1  1-->7
* G7
* G6
* G5
* G4
* A
* B
* 111
* 110
* 101
* 100
* Doğruluk
* Mantık devresi
* Girişler
* Kodlayıcı
* Çıkışlar
* G3
* G2
* G1
* G0
* 010
* 001
* 011
* 000
* C
* Girişler                                                 Çıkışlar
* G9 G8 G7 G6 G5 G4 G3 G2 G1 G0  A B C D
* 0    0    0    0    0   0    0   0    0    1    0  0  0  0-->0
* 0    0    0   0    0    0   0    0   1     0    0  0  0  1-->1
* 0    0    0    0    0   0    0   1    0    0    0  0  1  0-->2
* 0    0    0    0    0   0    1   0     0   0    0  0  1  1-->3
* 0    0    0    0    0   1    0   0    0    0    0  1  0  0-->4
* 0    0    0    0    1   0    0   0    0    0    0  1  0  1-->5
* 0    0    0    1    0   0    0   0    0    0    0  1  1  0-->6
* 0    0    1    0    0   0    0   0    0    0    0  1  1  1-->7
* 0    1    0    0    0   0    0   0    0    0    1  0  0  0-->8
* 1    0    0    0    0   0    0   0    0    0    1  0  0  1-->9
* BCD Doğruluk
* 1
* 2
* 4
* 8
* 1
* 2
* 4
* 8
* 3
* 5
* 6
* 7
* 9
* 10
* 11
* 12
* 13
* 14
* 15
* 1
* 2
* 4
* 8
* 1
* 2
* 4
* 8
* 3
* 5
* 6
* 7
* 9
* 10
* 11
* 12
* 13
* 14
* 15
.lib UniversalOpAmp1.lib
.backanno
.end